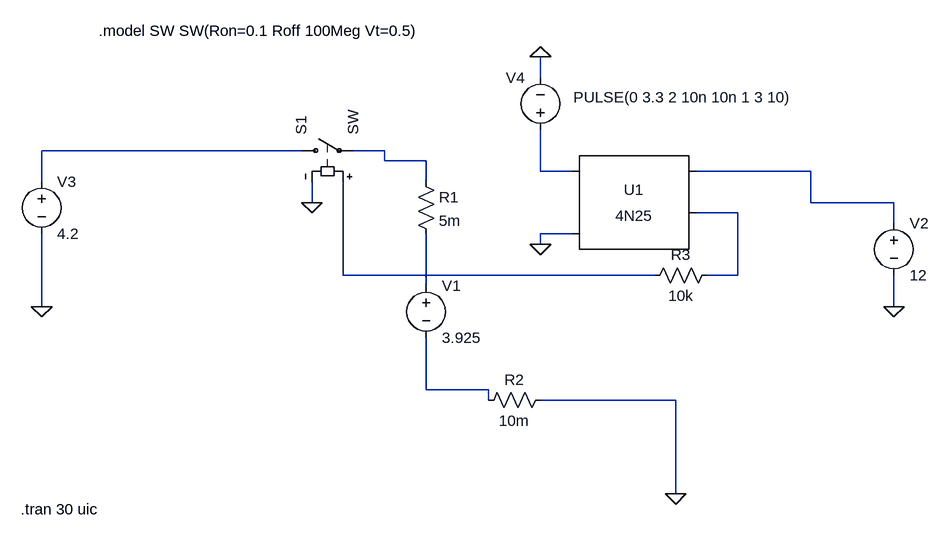
[diagram p0: schematic neuer mosfet test.asc]
neuer mosfet test.asc, the LTspice schematic file:
Version 4.1
SHEET 1 1100 680
WIRE 208 -352 208 -384
WIRE -160 -240 -560 -240
WIRE -32 -240 -80 -240
WIRE -32 -224 -32 -240
WIRE 32 -224 -32 -224
WIRE 208 -208 208 -272
WIRE 256 -208 208 -208
WIRE 624 -208 448 -208
WIRE -560 -192 -560 -240
WIRE 32 -192 32 -224
WIRE -144 -160 -144 -192
WIRE 624 -160 624 -208
WIRE 752 -160 624 -160
WIRE 512 -144 448 -144
WIRE 752 -128 752 -160
WIRE 256 -112 208 -112
WIRE 208 -96 208 -112
WIRE -96 -48 -96 -192
WIRE 384 -48 -96 -48
WIRE 512 -48 512 -144
WIRE 512 -48 464 -48
WIRE 32 -32 32 -112
WIRE -560 0 -560 -112
WIRE 752 0 752 -48
WIRE 32 128 32 48
WIRE 128 128 32 128
WIRE 128 144 128 128
WIRE 416 144 208 144
WIRE 416 288 416 144
FLAG 416 288 0
FLAG 752 0 0
FLAG -560 0 0
FLAG -144 -160 0
FLAG 208 -96 0
FLAG 208 -384 0
SYMBOL voltage 32 -48 R0
WINDOW 123 0 0 Left 0
WINDOW 39 0 0 Left 0
SYMATTR InstName V1
SYMATTR Value 3.925
SYMBOL res 16 -208 R0
SYMATTR InstName R1
SYMATTR Value 5m
SYMBOL voltage 752 -144 R0
WINDOW 123 0 0 Left 0
WINDOW 39 0 0 Left 0
SYMATTR InstName V2
SYMATTR Value 12
SYMBOL voltage -560 -208 R0
WINDOW 123 0 0 Left 0
WINDOW 39 0 0 Left 0
SYMATTR InstName V3
SYMATTR Value 4.2
SYMBOL res 224 128 R90
WINDOW 0 0 56 VBottom 2
WINDOW 3 32 56 VTop 2
SYMATTR InstName R2
SYMATTR Value 10m
SYMBOL sw -176 -240 R270
SYMATTR InstName S1
SYMBOL Optos\\4N25 352 -144 R0
SYMATTR InstName U1
SYMBOL voltage 208 -256 R180
WINDOW 0 24 96 Left 2
WINDOW 3 -388 66 Left 2
WINDOW 123 0 0 Left 0
WINDOW 39 0 0 Left 0
SYMATTR InstName V4
SYMATTR Value PULSE(0 3.3 2 10n 10n 1 3 10)
SYMBOL res 480 -64 R90
WINDOW 0 0 56 VBottom 2
WINDOW 3 32 56 VTop 2
SYMATTR InstName R3
SYMATTR Value 10k
TEXT -592 312 Left 2 !.tran 30 uic
TEXT -472 -424 Left 2 !.model SW SW(Ron=0.1 Roff 100Meg Vt=0.5)

The netlist it stands for:
* neuer mosfet test.asc
V1 N007 N008 3.925
R1 N002 N007 5m
V2 N004 0 12
V3 N001 0 4.2
R2 0 N008 10m
S1 N001 N002 N006 0 SW
X§U1 N003 0 N004 N005 NC_01 4N25
V4 N003 0 PULSE(0 3.3 2 10n 10n 1 3 10)
R3 N005 N006 10k
.tran 30 uic
.model SW SW(Ron=0.1 Roff 100Meg Vt=0.5)
.lib 4N25.sub
.backanno
.end